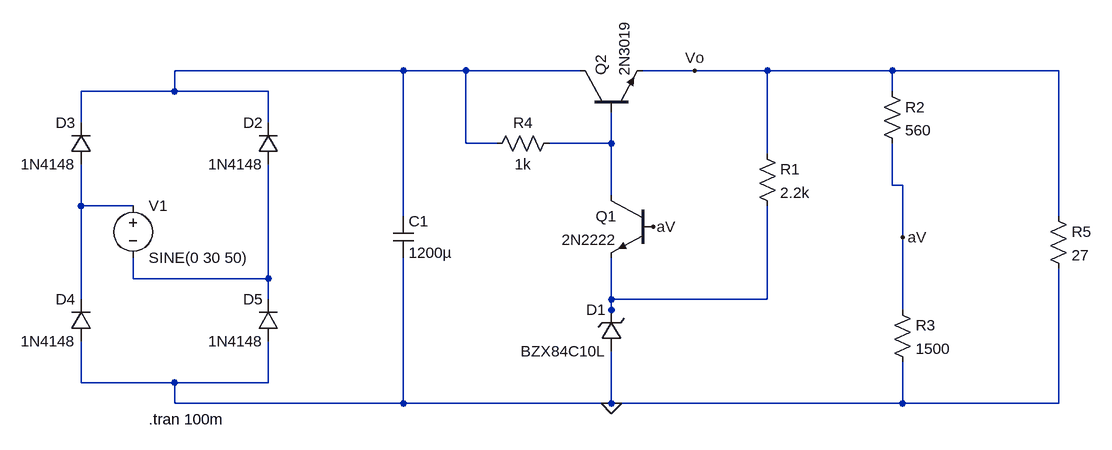
[diagram p0: schematic linear_rps_15V.asc]
linear_rps_15V.asc, the LTspice schematic file:
Version 4
SHEET 1 1280 680
WIRE -16 -80 -368 -80
WIRE 80 -80 -16 -80
WIRE 256 -80 80 -80
WIRE 432 -80 352 -80
WIRE 544 -80 432 -80
WIRE 736 -80 544 -80
WIRE 992 -80 736 -80
WIRE -368 -48 -368 -80
WIRE -368 -48 -512 -48
WIRE -224 -48 -368 -48
WIRE 736 -48 736 -80
WIRE -512 0 -512 -48
WIRE -224 0 -224 -48
WIRE 80 32 80 -80
WIRE 128 32 80 32
WIRE 304 32 304 -16
WIRE 304 32 208 32
WIRE 544 48 544 -80
WIRE 736 96 736 32
WIRE 752 96 736 96
WIRE 304 112 304 32
WIRE -512 128 -512 64
WIRE -432 128 -512 128
WIRE -16 144 -16 -80
WIRE 992 144 992 -80
WIRE 752 176 752 96
WIRE -432 240 -432 208
WIRE -224 240 -224 64
WIRE -224 240 -432 240
WIRE -512 272 -512 128
WIRE -224 272 -224 240
WIRE 304 272 304 208
WIRE 544 272 544 128
WIRE 544 272 304 272
WIRE 304 288 304 272
WIRE 752 288 752 176
WIRE 304 304 304 288
WIRE -512 400 -512 336
WIRE -368 400 -512 400
WIRE -224 400 -224 336
WIRE -224 400 -368 400
WIRE -368 432 -368 400
WIRE -16 432 -16 208
WIRE -16 432 -368 432
WIRE 304 432 304 352
WIRE 304 432 -16 432
WIRE 752 432 752 368
WIRE 752 432 304 432
WIRE 992 432 992 224
WIRE 992 432 752 432
FLAG 752 176 aV
FLAG 368 160 aV
FLAG 304 432 0
FLAG 432 -80 Vo
SYMBOL npn 368 112 M0
SYMATTR InstName Q1
SYMATTR Value 2N2222
SYMBOL npn 256 -16 R270
SYMATTR InstName Q2
SYMATTR Value 2N3019
SYMBOL zener 320 352 R180
WINDOW 0 24 64 Left 2
WINDOW 3 24 0 Left 2
SYMATTR InstName D1
SYMATTR Value BZX84C10L
SYMBOL res 528 32 R0
SYMATTR InstName R1
SYMATTR Value 2.2k
SYMBOL res 720 -64 R0
SYMATTR InstName R2
SYMATTR Value 560
SYMBOL res 736 272 R0
SYMATTR InstName R3
SYMATTR Value 1500
SYMBOL res 112 48 R270
WINDOW 0 32 56 VTop 2
WINDOW 3 0 56 VBottom 2
SYMATTR InstName R4
SYMATTR Value 1k
SYMBOL res 976 128 R0
SYMATTR InstName R5
SYMATTR Value 27
SYMBOL diode -208 64 R180
WINDOW 0 24 64 Left 2
WINDOW 3 24 0 Left 2
SYMATTR InstName D2
SYMATTR Value 1N4148
SYMBOL diode -496 64 R180
WINDOW 0 24 64 Left 2
WINDOW 3 24 0 Left 2
SYMATTR InstName D3
SYMATTR Value 1N4148
SYMBOL diode -496 336 R180
WINDOW 0 24 64 Left 2
WINDOW 3 24 0 Left 2
SYMATTR InstName D4
SYMATTR Value 1N4148
SYMBOL diode -208 336 R180
WINDOW 0 24 64 Left 2
WINDOW 3 24 0 Left 2
SYMATTR InstName D5
SYMATTR Value 1N4148
SYMBOL cap -32 144 R0
SYMATTR InstName C1
SYMATTR Value 1200µ
SYMBOL voltage -432 112 R0
WINDOW 123 0 0 Left 0
WINDOW 39 0 0 Left 0
SYMATTR InstName V1
SYMATTR Value SINE(0 30 50)
TEXT -408 456 Left 2 !.tran 100m

The netlist it stands for:
* linear_rps_15V.asc
Q1 N002 aV N005 0 2N2222
Q2 N001 N002 Vo 0 2N3019
D1 0 N005 BZX84C10L
R1 Vo N005 2.2k
R2 Vo aV 560
R3 aV 0 1500
R4 N001 N002 1k
R5 Vo 0 27
D2 N004 N001 1N4148
D3 N003 N001 1N4148
D4 0 N003 1N4148
D5 0 N004 1N4148
C1 N001 0 1200µ
V1 N003 N004 SINE(0 30 50)
.model D D
.lib standard.dio
.model NPN NPN
.model PNP PNP
.lib standard.bjt
.tran 100m
.backanno
.end